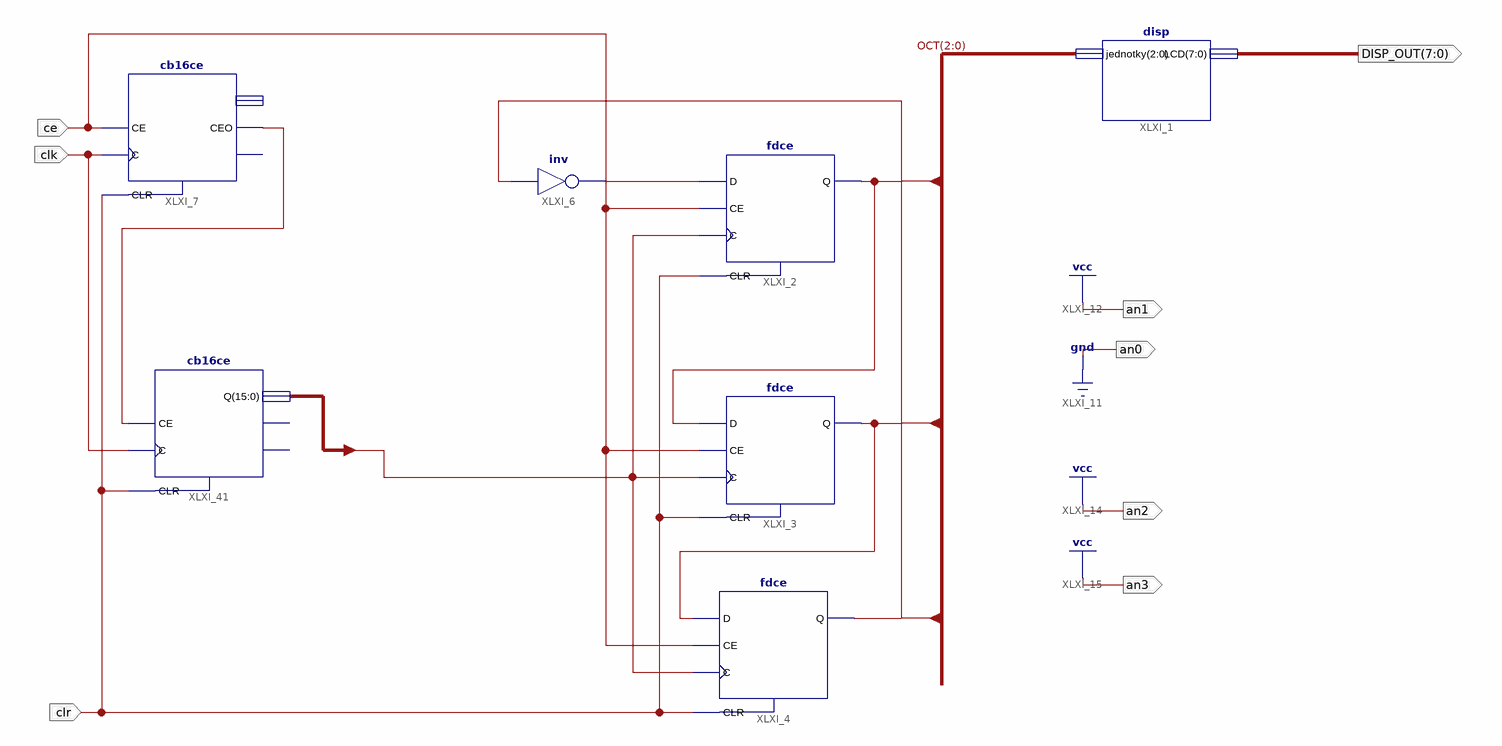
[diagram p0: schematic sheet 1]
// Xilinx ISE schematic kostka.sch (spartan6) as structural Verilog: 7 symbols, 8 ports
module kostka (
  input  ce,
  input  clr,
  input  clk,
  output [7:0] DISP_OUT,
  output an0,
  output an1,
  output an2,
  output an3
);

  wire XLXN_6, XLXN_28;
  wire [2:0] OCT;
  wire [15:0] Counter;

  disp XLXI_1 (.LCD(DISP_OUT), .jednotky(OCT));
  fdce XLXI_3 (.C(Counter[3]), .CE(ce), .CLR(clr), .D(OCT[0]), .Q(OCT[1]));
  fdce XLXI_4 (.C(Counter[3]), .CE(ce), .CLR(clr), .D(OCT[1]), .Q(OCT[2]));
  fdce XLXI_2 (.C(Counter[3]), .CE(ce), .CLR(clr), .D(XLXN_6), .Q(OCT[0]));
  not XLXI_6 (XLXN_6, OCT[2]);
  cb16ce XLXI_7 (.C(clk), .CE(ce), .CLR(clr), .CEO(XLXN_28));  // open: Q, TC
  cb16ce XLXI_41 (.C(clk), .CE(XLXN_28), .CLR(clr), .Q(Counter));  // open: CEO, TC

  assign an0 = 1'b0;
  assign an1 = 1'b1;
  assign an2 = 1'b1;
  assign an3 = 1'b1;
endmodule
